# EAGLE design Schematics (EAGLE 8.7.1)
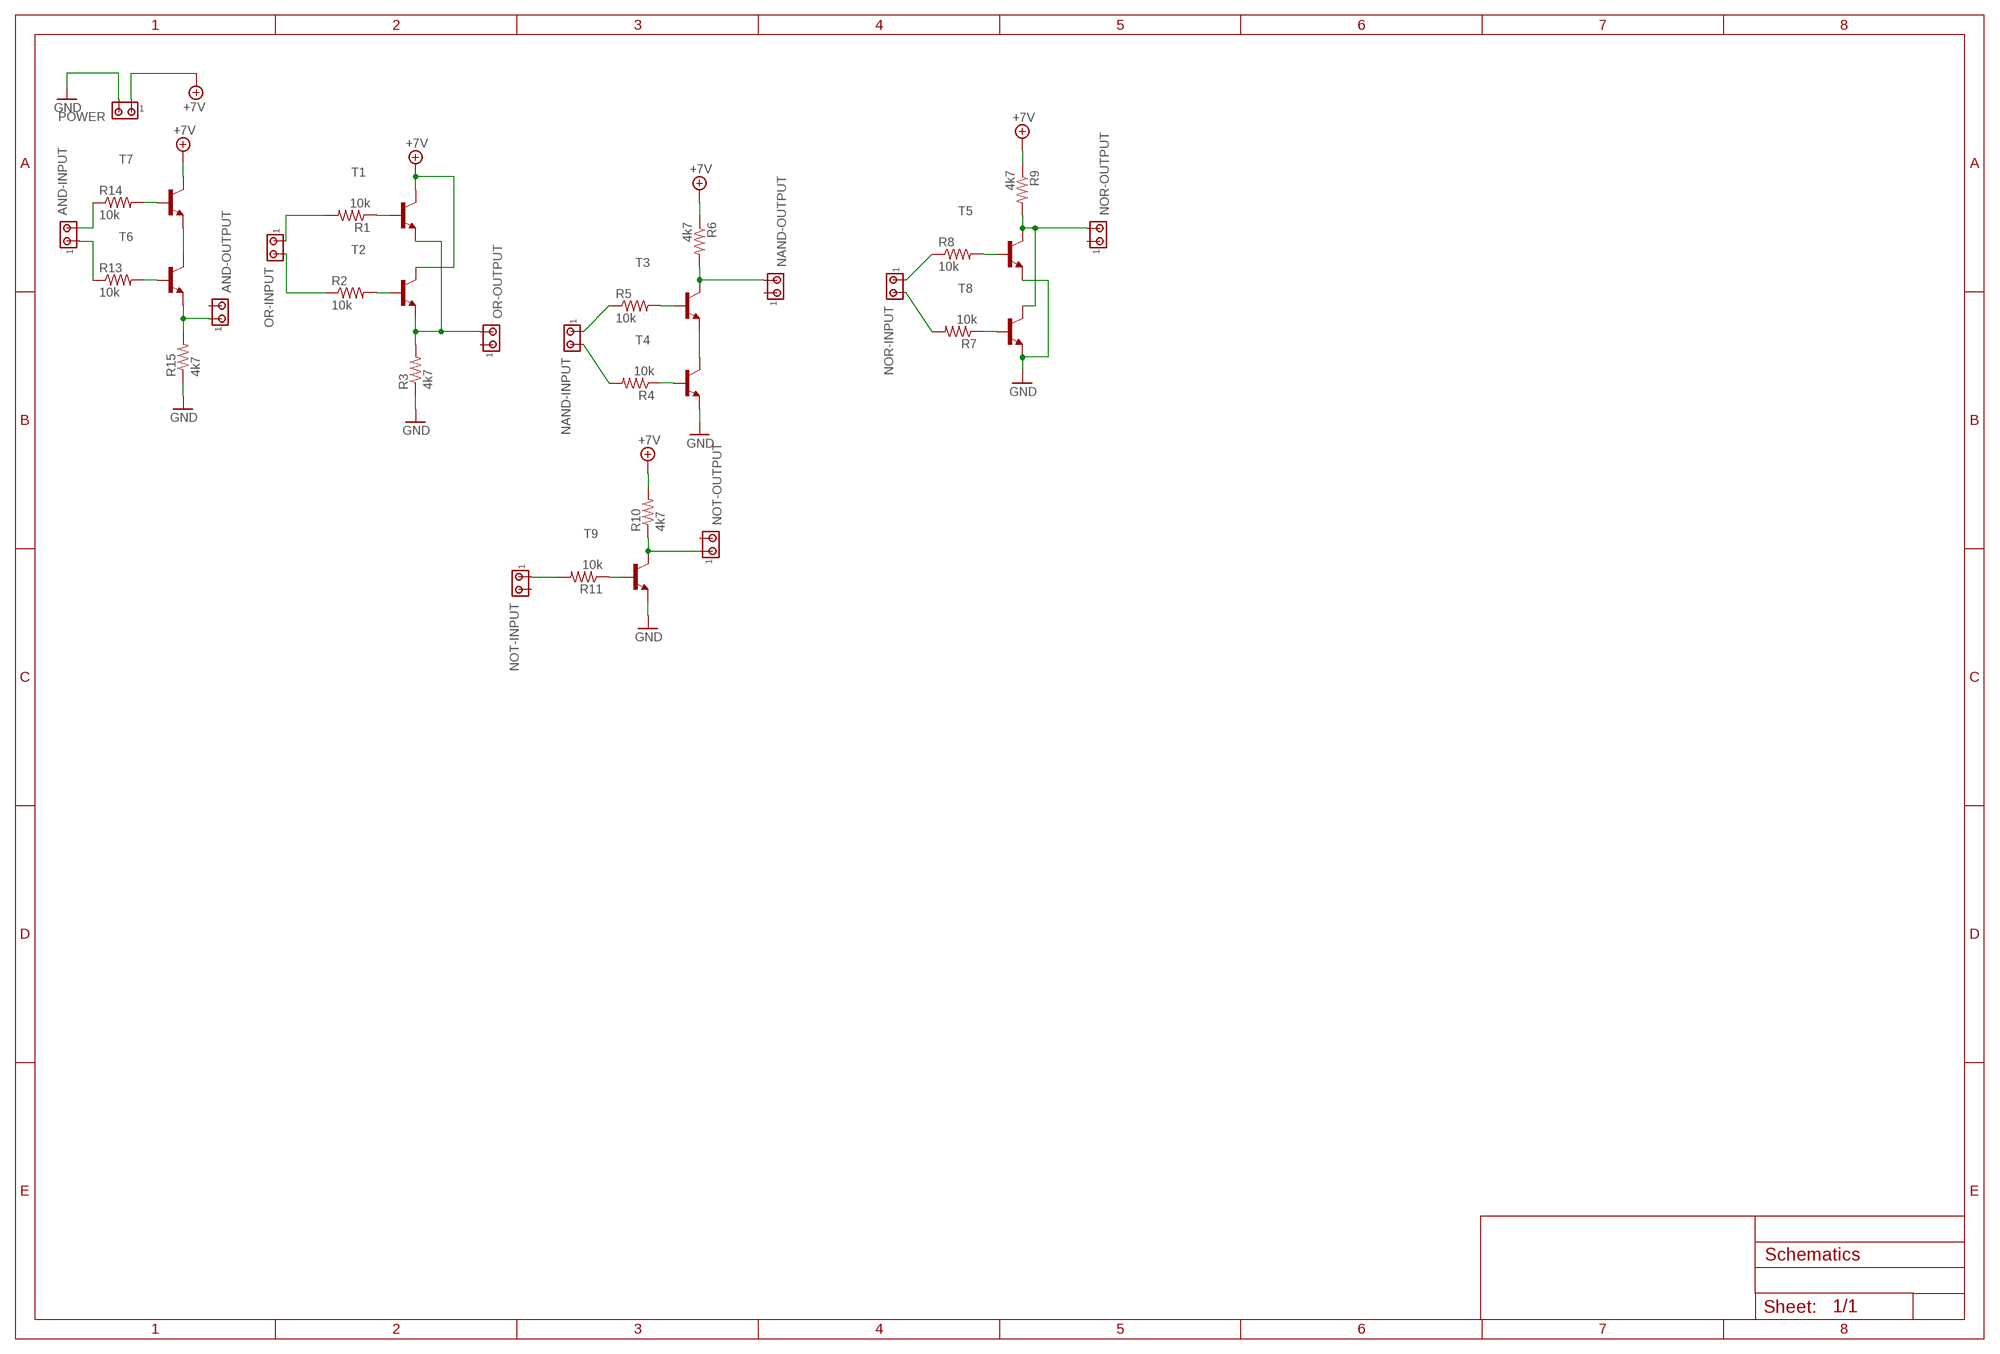
[diagram p0: schematic, sheet 1]

## Parts
AND-INPUT  MTA02-100  [10X02MTA]
AND-OUTPUT  MTA02-100  [10X02MTA]
NAND-INPUT  MTA02-100  [10X02MTA]
NAND-OUTPUT  MTA02-100  [10X02MTA]
NOR-INPUT  MTA02-100  [10X02MTA]
NOR-OUTPUT  MTA02-100  [10X02MTA]
NOT-INPUT  MTA02-100  [10X02MTA]
NOT-OUTPUT  MTA02-100  [10X02MTA]
OR-INPUT  MTA02-100  [10X02MTA]
OR-OUTPUT  MTA02-100  [10X02MTA]
POWER  MTA02-100  [10X02MTA]
R1  10k  R-US_0309/12  [0309/12]
R2  10k  R-US_0309/12  [0309/12]
R3  4k7  R-US_0309/12  [0309/12]
R4  10k  R-US_0309/12  [0309/12]
R5  10k  R-US_0309/12  [0309/12]
R6  4k7  R-US_0309/12  [0309/12]
R7  10k  R-US_0309/12  [0309/12]
R8  10k  R-US_0309/12  [0309/12]
R9  4k7  R-US_0309/12  [0309/12]
R10  4k7  R-US_0309/12  [0309/12]
R11  10k  R-US_0309/12  [0309/12]
R13  10k  R-US_0309/12  [0309/12]
R14  10k  R-US_0309/12  [0309/12]
R15  4k7  R-US_0309/12  [0309/12]
T1  -NPN-TO92-EBC  [TO92-EBC]
T2  -NPN-TO92-EBC  [TO92-EBC]
T3  -NPN-TO92-EBC  [TO92-EBC]
T4  -NPN-TO92-EBC  [TO92-EBC]
T5  -NPN-TO92-EBC  [TO92-EBC]
T6  -NPN-TO92-EBC  [TO92-EBC]
T7  -NPN-TO92-EBC  [TO92-EBC]
T8  -NPN-TO92-EBC  [TO92-EBC]
T9  -NPN-TO92-EBC  [TO92-EBC]

## Nets
+7V: POWER.1 R6.1 R9.1 R10.2 T1.C T2.C T7.C
GND: POWER.2 R3.1 R15.1 T4.E T5.E T8.E T9.E
N$1: NAND-OUTPUT.2 R6.2 T3.C
N$2: T6.C T7.E
N$3: R13.2 T6.B
N$4: R14.2 T7.B
N$5: AND-INPUT.2 R14.1
N$6: AND-INPUT.1 R13.1
N$7: AND-OUTPUT.1 R15.2 T6.E
N$8: OR-INPUT.1 R1.2
N$9: OR-INPUT.2 R2.1
N$10: R2.2 T2.B
N$11: R1.1 T1.B
N$12: OR-OUTPUT.2 R3.2 T1.E T2.E
N$13: R5.2 T3.B
N$14: NAND-INPUT.1 R5.1
N$15: R4.1 T4.B
N$16: T3.E T4.C
N$17: NAND-INPUT.2 R4.2
N$18: NOR-OUTPUT.2 R9.2 T5.C T8.C
N$19: R8.2 T5.B
N$20: NOR-INPUT.1 R8.1
N$21: R7.1 T8.B
N$22: NOT-OUTPUT.1 R10.1 T9.C
N$23: NOR-INPUT.2 R7.2
N$24: R11.1 T9.B
N$25: NOT-INPUT.1 R11.2
Unconnected: AND-OUTPUT.2 NAND-OUTPUT.1 NOR-OUTPUT.1 NOT-INPUT.2 NOT-OUTPUT.2 OR-OUTPUT.1

## Library data of the parts
AND-INPUT AND-OUTPUT NAND-INPUT NAND-OUTPUT NOR-INPUT NOR-OUTPUT NOT-INPUT NOT-OUTPUT OR-INPUT OR-OUTPUT POWER = con-amp:MTA02-100: AMP connector
R1-R11 R13-R15 = rcl:R-US_: RESISTOR, American symbol; SPICEPREFIX: R
T1-T9 = transistor-neu-to92:*-NPN-: NPN Transistror

## Board
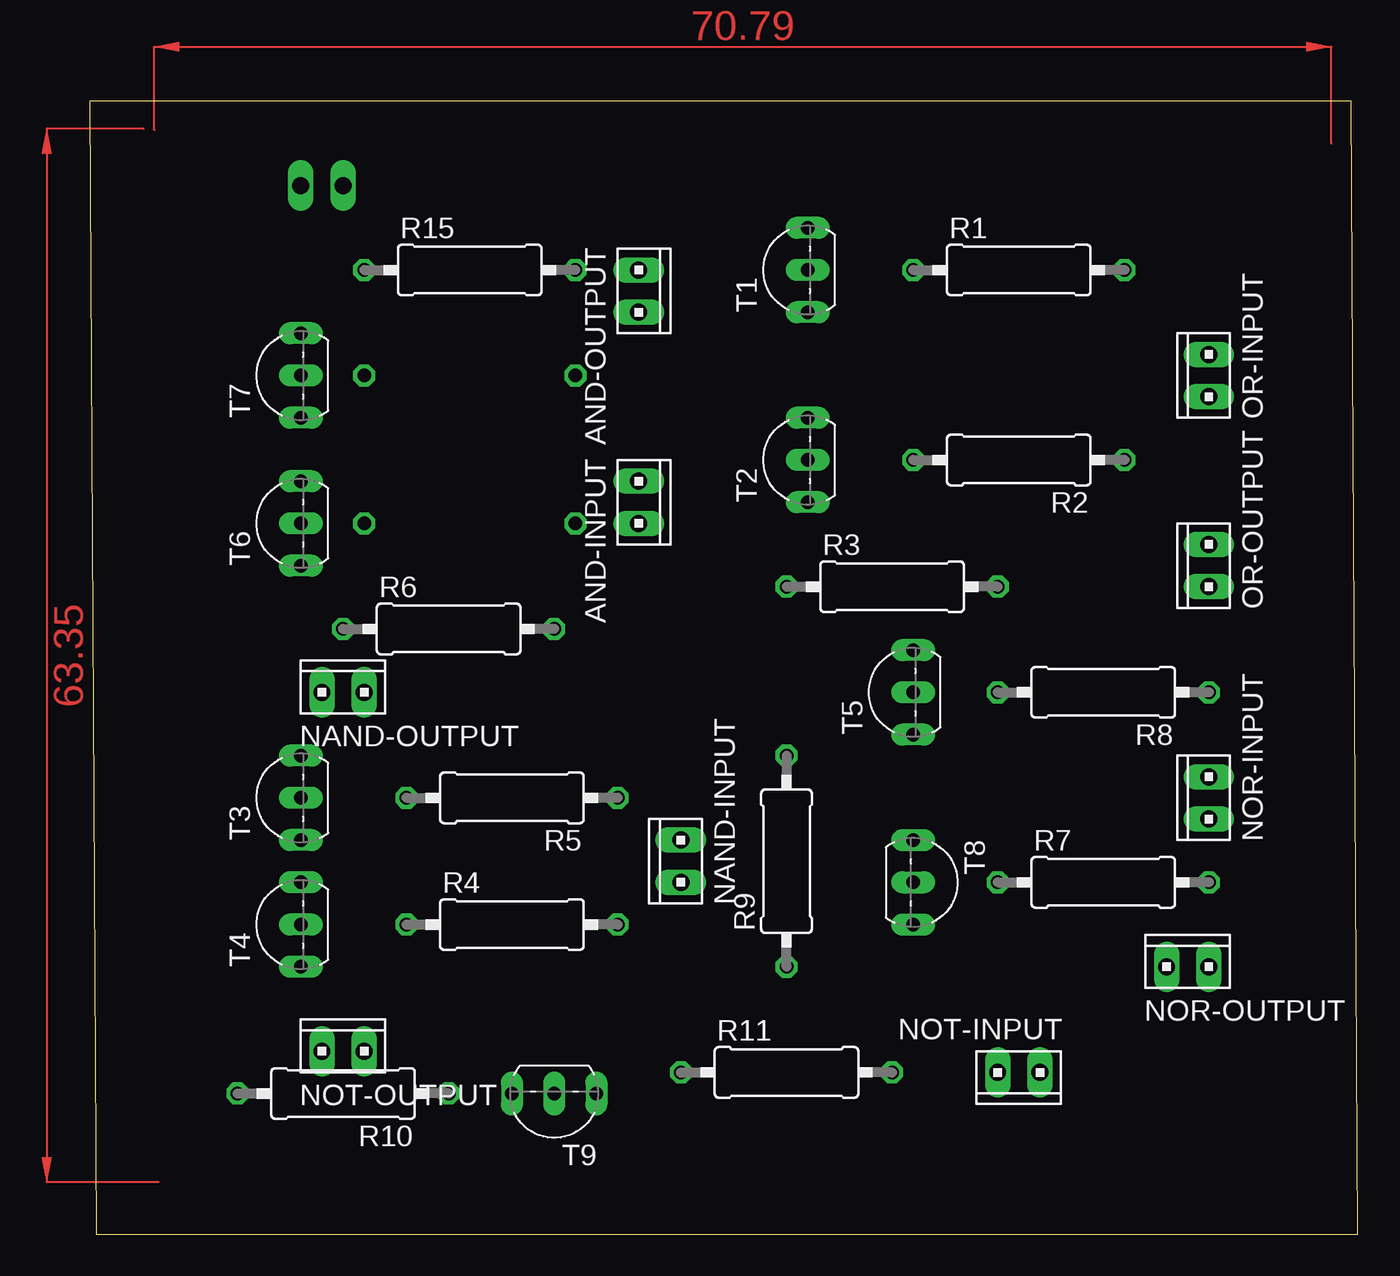
[diagram p1: board, top side]
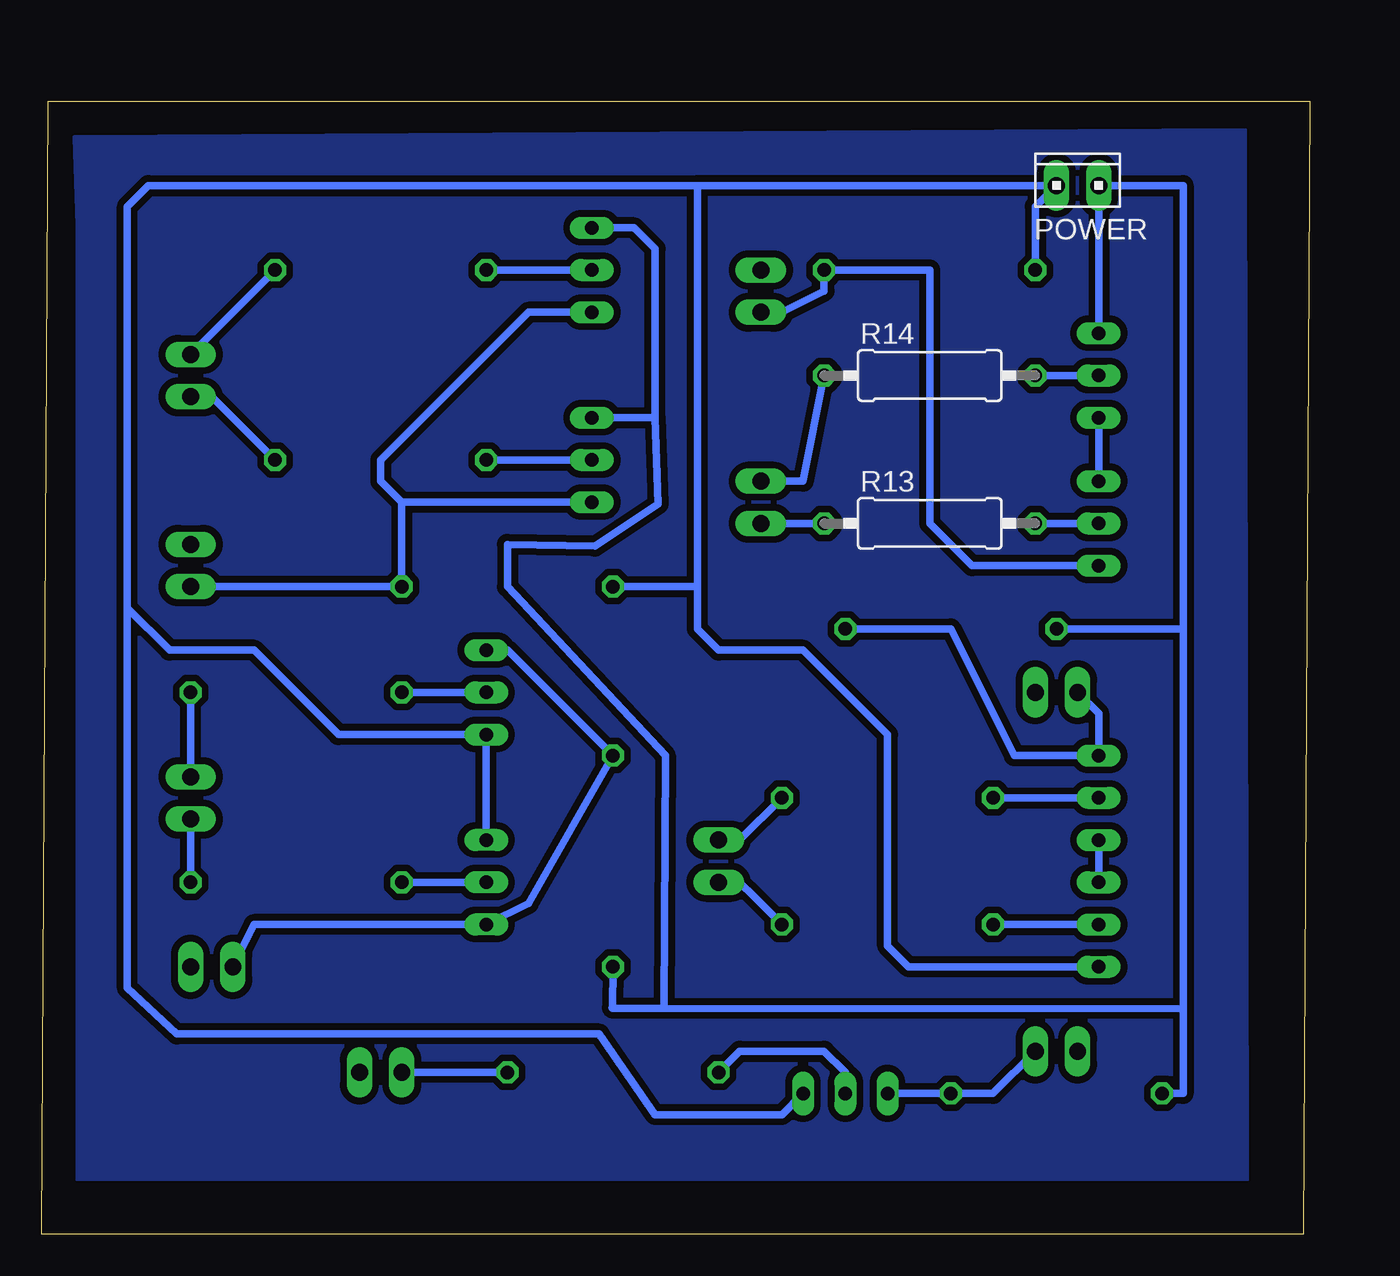
[diagram p2: board, bottom side, seen from below]

Size 76.28 x 68.14 mm. Coordinates in mm from the lower left corner, seen from the top.
Outline: 0.41,0 76.28,0 75.87,68.14 0,68.14 0.41,0
Copper layers (1*16): Top 0.035mm / dielectric 1.5mm / Bottom 0.035mm
Design rules "default *": minimum track width 6mil, minimum drill 0.35mm, track to track 6mil, track to pad 6mil, pad to pad 6mil, via to via 6mil, smd to smd 6mil, copper to edge 40mil, drill to drill 6mil, minimum pad ring 10mil, minimum via ring 8mil, stop-mask expansion 4mil, vias tented up to drill 0mil, thermal gap 10mil

### Footprints (pad centres in the part's own frame; a part is rotated, then mirrored left to right if it is on the bottom)
10X02MTA = drill 1.016 long: 1 1.27,0; 2 -1.27,0
0309/12 = drill 0.813 octagon: 1 -6.35,0; 2 6.35,0
TO92-EBC = drill 0.813 long: B 0,-1.27; C 2.54,-1.27; E -2.54,-1.27

### Placement (x,y rotation side)
AND-INPUT  33.02,44.02 270 top
AND-OUTPUT  33.02,56.72 270 top
NAND-INPUT  35.56,22.43 90 top
NAND-OUTPUT  15.24,32.59 0 top
NOR-INPUT  67.31,26.24 90 top
NOR-OUTPUT  66.04,16.08 0 top
NOT-INPUT  55.88,9.73 180 top
NOT-OUTPUT  15.24,11 0 top
OR-INPUT  67.31,51.64 90 top
OR-OUTPUT  67.31,40.21 90 top
POWER  13.97,63.07 0 bottom
R1  55.88,57.99 0 top
R2  55.88,46.56 180 top
R3  48.26,38.94 0 top
R4  25.4,18.62 0 top
R5  25.4,26.24 180 top
R6  21.59,36.4 0 top
R7  60.96,21.16 0 top
R8  60.96,32.59 180 top
R9  41.91,22.43 90 top
R10  15.24,8.46 180 top
R11  41.91,9.73 0 top
R13  22.86,42.75 0 bottom
R14  22.86,51.64 0 bottom
R15  22.86,57.99 0 top
T1  41.91,57.99 90 top
T2  41.91,46.56 90 top
T3  11.43,26.24 90 top
T4  11.43,18.62 90 top
T5  48.26,32.59 90 top
T6  11.43,42.75 90 top
T7  11.43,51.64 90 top
T8  50.8,21.16 270 top
T9  27.94,7.19 180 top

### Tracks (layer width: path | path; a pad name or v marks a point on that pad's centre or on a via)
+7V
  Bottom 0.457: T7.C POWER.1 7.62,63.07 7.62,36.4 | 39.37,49.1 39.37,59.26 40.64,60.53 T1.C | 7.62,13.54 38.84,13.59 | 38.84,13.59 41.94,13.59 | 41.94,13.59 41.96,13.61 | 7.62,36.4 7.62,13.54 | 39.37,49.1 39.19,43.92 43,41.38 48.26,41.48 48.26,38.94 38.76,28.78 38.84,13.59 | R6.1 7.62,36.4 | R9.1 41.94,13.59 | T2.C 39.37,49.1 | 7.62,13.54 7.62,8.46 R10.2
GND
  Bottom 0.457: R15.1 16.51,61.8 POWER.2 36.83,63.07 | R3.1 36.83,38.94 | 36.83,38.94 36.83,63.07 | T4.E 24.13,16.08 25.4,17.35 25.4,30.05 30.48,35.13 35.56,35.13 36.83,36.4 36.83,38.94 | T8.E T5.E 58.42,30.05 63.5,35.13 68.58,35.13 71.12,37.67 | 71.12,37.67 71.12,61.8 69.85,63.07 36.83,63.07 | 71.12,37.67 71.12,14.81 68.15,12.04 42.75,12.04 39.37,7.19 31.75,7.19 T9.E
N$1
  Bottom 0.457: R6.2 21.59,36.4 17.78,28.78 T3.C 12.7,31.32 NAND-OUTPUT.2
N$2
  Bottom 0.457: T7.E T6.C
N$3
  Bottom 0.457: T6.B R13.2
N$4
  Bottom 0.457: R14.2 T7.B
N$5
  Bottom 0.457: R14.1 30.48,45.29 AND-INPUT.2
N$6
  Bottom 0.457: R13.1 AND-INPUT.1
N$7
  Bottom 0.457: AND-OUTPUT.1 31.75,55.45 29.21,56.72 R15.2 22.86,57.99 22.86,42.75 20.32,40.21 T6.E
N$8
  Bottom 0.457: R1.2 OR-INPUT.1
N$9
  Bottom 0.457: R2.1 66.04,50.37 OR-INPUT.2
N$10
  Bottom 0.457: R2.2 T2.B
N$11
  Bottom 0.457: R1.1 T1.B
N$12
  Bottom 0.457: 54.61,44.02 55.88,45.29 55.88,46.56 46.99,55.45 T1.E | 54.61,44.02 T2.E | 54.61,44.02 R3.2 OR-OUTPUT.2
N$13
  Bottom 0.457: R5.2 T3.B
N$14
  Bottom 0.457: NAND-INPUT.1 34.29,23.7 R5.1
N$15
  Bottom 0.457: R4.1 T4.B
N$16
  Bottom 0.457: T4.C T3.E
N$17
  Bottom 0.457: R4.2 33.4,20.27 34.29,21.16 NAND-INPUT.2
N$18
  Bottom 0.457: T5.C 48.26,35.13 R9.2 46.99,19.89 T8.C 63.5,18.62 NOR-OUTPUT.2
N$19
  Bottom 0.457: R8.2 T5.B
N$20
  Bottom 0.457: NOR-INPUT.1 R8.1
N$21
  Bottom 0.457: R7.1 T8.B
N$22
  Bottom 0.457: T9.C R10.1 19.05,8.46 NOT-OUTPUT.1
N$23
  Bottom 0.457: R7.2 NOR-INPUT.2
N$24
  Bottom 0.457: T9.B 27.94,9.73 29.21,11 34.29,11 R11.1
N$25
  Bottom 0.457: R11.2 NOT-INPUT.1
N$26
  pour Bottom (isolate 0.406): 74.32,65.96 74.14,60.66 74.14,3.33 3.76,3.33 3.76,3.48 3.89,66.4
(copper drawn outside any net)
  shapes: Top area x2